# EAGLE design trezor_v1.2-USB-C (EAGLE 7.3.0)
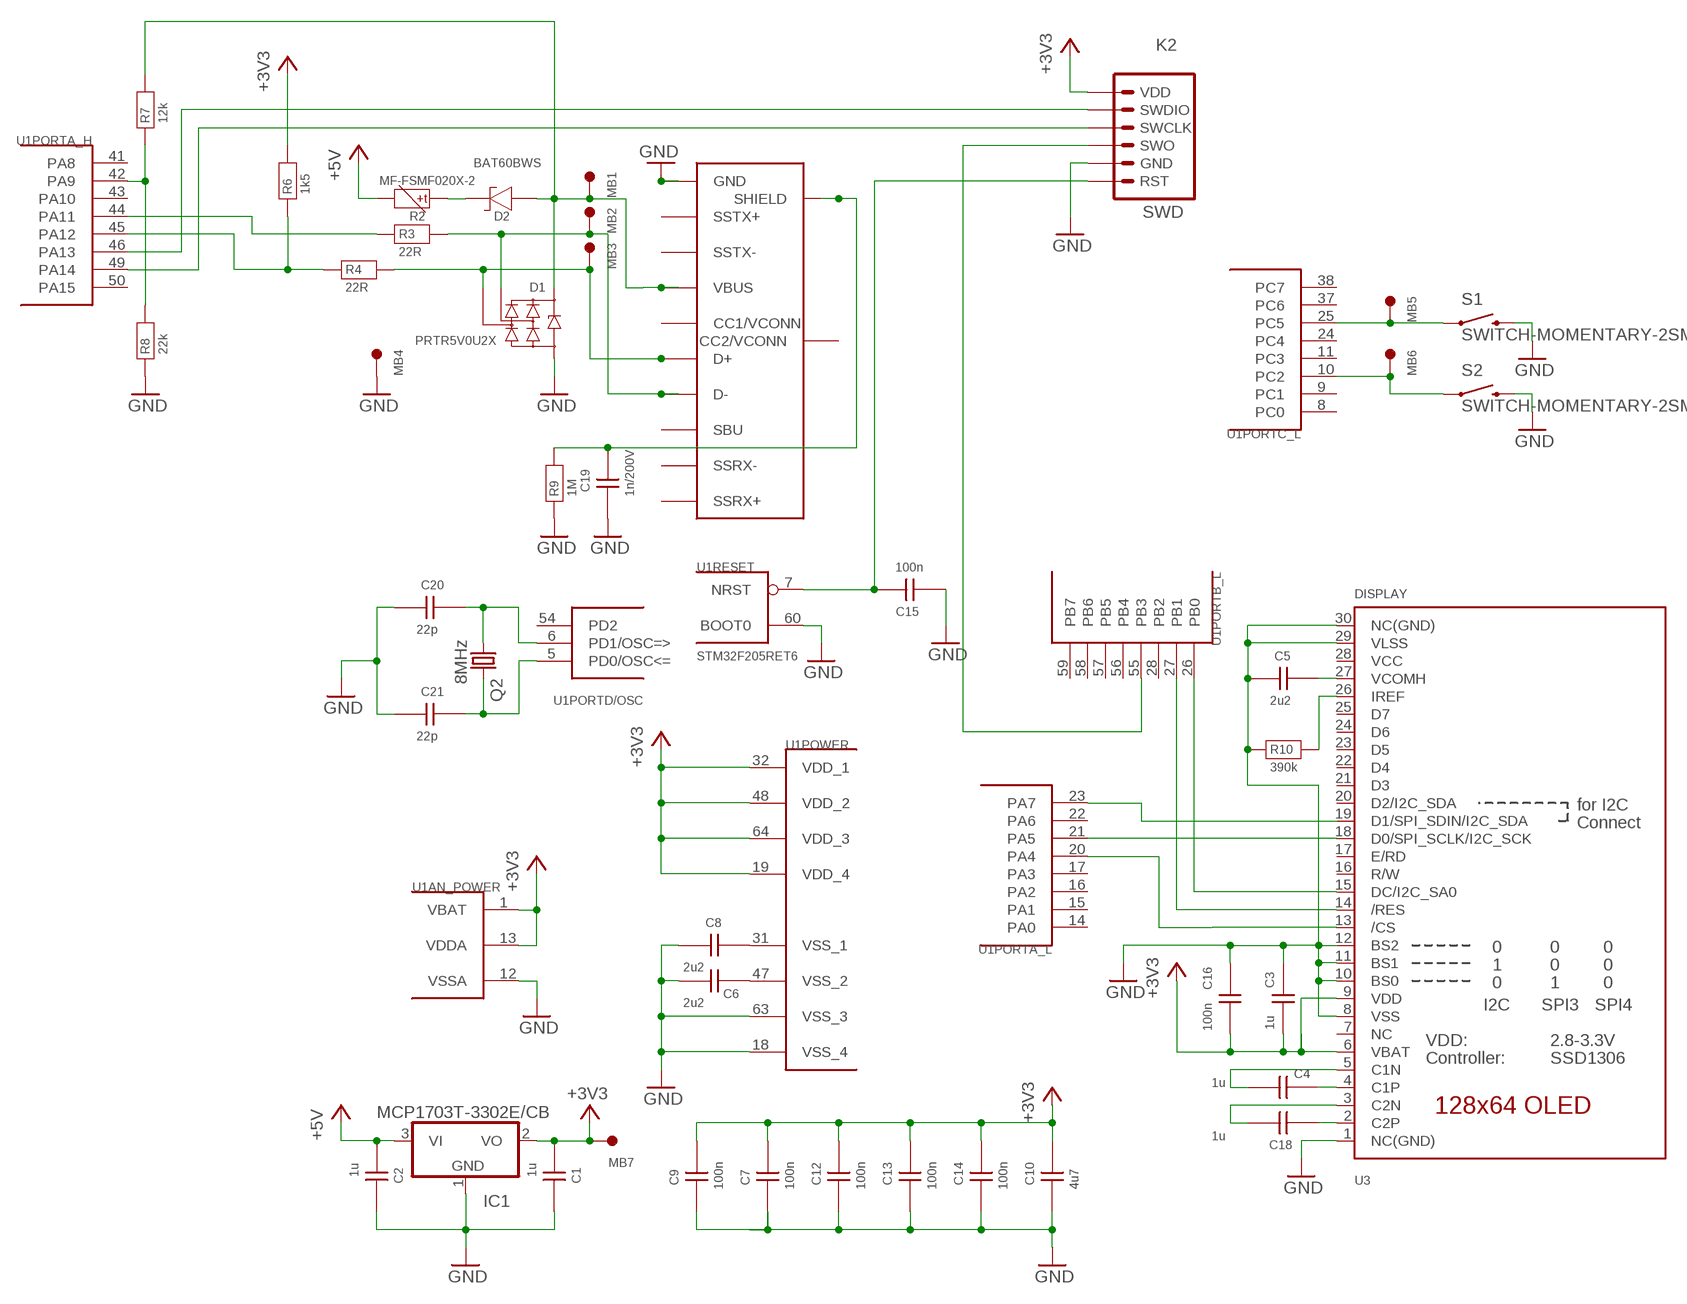
[diagram p0: schematic, sheet 1]

## Parts
C1  1u  C_0402  [0402]
C2  1u  C_0402  [0402]
C3  1u  C_0402  [0402]
C4  1u  C_0402  [0402]
C5  2u2  C_0603  [0603]
C6  2u2  C_0402  [0402]
C7  100n  C_0402  [0402]
C8  2u2  C_0402  [0402]
C9  100n  C_0402  [0402]
C10  4u7  C_0603  [0603]
C12  100n  C_0402  [0402]
C13  100n  C_0402  [0402]
C14  100n  C_0402  [0402]
C15  100n  C_0402  [0402]
C16  100n  C_0402  [0402]
C18  1u  C_0402  [0402]
C19  1n/200V  C_0603  [0603]
C20  22p  C_0402  [0402]
C21  22p  C_0402  [0402]
D1  PRTR5V0U2X  PRTR5V0_SOT143B  [SOT143B]
D2  BAT60BWS  DS_SOD323  [SOD323]
IC1  MCP1703T-3302E/CB  MCP1703CB  [SOT23]
K2  SWD  [SWD]
MB1  MB_1.50  [MB1.5]
MB2  MB_1.50  [MB1.5]
MB3  MB_1.50  [MB1.5]
MB4  MB_1.50  [MB1.5]
MB5  MB_1.50  [MB1.5]
MB6  MB_1.50  [MB1.5]
MB7  MB_1.50  [MB1.5]
Q2  8MHz  CRYSTALCTS406  [CTS406]
R2  MF-FSMF020X-2  POLYSWITCH_0603  [0603]
R3  22R  R_0402  [0402]
R4  22R  R_0402  [0402]
R6  1k5  R_0402  [0402]
R7  12k  R_0402  [0402]
R8  22k  R_0402  [0402]
R9  1M  R_0603  [0603]
R10  390k  R_0402  [0402]
S1  SWITCH-MOMENTARY-2SMD  [TACTILE_SWITCH_SMD]
S2  SWITCH-MOMENTARY-2SMD  [TACTILE_SWITCH_SMD]
U1  STM32F205RET6  STM32F10XRXT6  [TQFP64]
U3  DISPLAY  DISP_OLED_UG-2864HSWEG010.96"  [UG-2864HSWEG01_0.96IN_WRAPAROUND]
U$1  USB-TYPE-CHYBRID  [USB-TYPE-C-HYBRID]

## Nets
+3V3: C1.P$1 C3.P$1 C7.P$2 C9.P$2 C10.2 C12.P$2 C13.P$2 C14.P$2 C16.P$1 IC1.2(VO) K2.6(VDD) MB7.1 R6.P$2 U1.1(AN_POWER:VBAT) U1.13(AN_POWER:VDDA) U1.19(POWER:VDD_4) U1.32(POWER:VDD_1) U1.48(POWER:VDD_2) U1.64(POWER:VDD_3) U3.6(VBAT) U3.9(VDD)
+5V: C2.P$1 IC1.3(VI) R2.2
GND: C1.P$2 C2.P$2 C3.P$2 C5.1 C6.P$1 C7.P$1 C8.P$1 C9.P$1 C10.1 C12.P$1 C13.P$1 C14.P$1 C15.P$1 C16.P$2 C19.1 C20.P$1 C21.P$1 D1.1(GND) IC1.1(GND) K2.2(GND) MB4.1 R8.P$1 R9.1 R10.P$1 S1.3 S1.4 S2.3 S2.4 U1.12(AN_POWER:VSSA) U1.18(POWER:VSS_4) U1.60(RESET:BOOT0) U1.63(POWER:VSS_3) U3.1(NC(GND)) U3.8(VSS) U3.10(BS0) U3.11(BS1) U3.12(BS2) U3.29(VLSS) U3.30(NC(GND)) U$1.1(GND) U$1.12(GND) U$1.B1(GND) U$1.B12(GND)
N$1: U1.23(PORTA_L:PA7) U3.19(D1/SPI_SDIN/I2C_SDA)
N$2: C15.P$2 K2.1(RST) U1.7(RESET:NRST)
N$3: U1.26(PORTB_L:PB0) U3.15(DC/I2C_SA0)
N$4: C8.P$2 U1.31(POWER:VSS_1)
N$5: U1.21(PORTA_L:PA5) U3.18(D0/SPI_SCLK/I2C_SCK)
N$6: C5.2 U3.27(VCOMH)
N$7: U1.27(PORTB_L:PB1) U3.14(/RES)
N$8: C6.P$2 U1.47(POWER:VSS_2)
N$9: R10.P$2 U3.26(IREF)
N$10: C18.P$1 U3.2(C2P)
N$11: C4.P$1 U3.4(C1P)
N$12: C18.P$2 U3.3(C2N)
N$13: C4.P$2 U3.5(C1N)
N$14: K2.3(SWO) U1.55(PORTB_L:PB3)
N$15: K2.5(SWDIO) U1.46(PORTA_H:PA13)
N$16: U1.20(PORTA_L:PA4) U3.13(/CS)
N$17: K2.4(SWCLK) U1.49(PORTA_H:PA14)
N$18: R3.P$1 U1.44(PORTA_H:PA11)
N$19: MB5.1 S1.1 S1.2 U1.25(PORTC_L:PC5)
N$20: MB6.1 S2.1 S2.2 U1.10(PORTC_L:PC2)
N$22: D2.K R2.1
N$23: D1.2(I/O1) MB2.1 R3.P$2 U$1.7(D-) U$1.B7(D-)
N$24: D1.3(I/O2) MB3.1 R4.P$2 U$1.6(D+) U$1.B6(D+)
N$26: C19.2 R9.2 U$1.P$1(SHIELD) U$1.P$2(SHIELD) U$1.P$3(SHIELD) U$1.P$4(SHIELD) U$1.P$7(SHIELD) U$1.P$8(SHIELD) U$1.P$9(SHIELD) U$1.P$10(SHIELD) U$1.P$11(SHIELD) U$1.P$12(SHIELD) U$1.P$13(SHIELD) U$1.P$14(SHIELD) U$1.P$15(SHIELD) U$1.P$16(SHIELD) U$1.P$17(SHIELD) U$1.P$18(SHIELD) U$1.P$19(SHIELD) U$1.P$20(SHIELD) U$1.P$21(SHIELD) U$1.P$22(SHIELD) U$1.P$23(SHIELD) U$1.P$24(SHIELD) U$1.P$25(SHIELD) U$1.P$26(SHIELD) U$1.P$27(SHIELD) U$1.P$28(SHIELD) U$1.P$29(SHIELD) U$1.P$30(SHIELD) U$1.P$31(SHIELD) U$1.P$32(SHIELD) U$1.P$33(SHIELD) U$1.P$34(SHIELD) U$1.P$35(SHIELD)
N$27: R7.P$1 R8.P$2 U1.42(PORTA_H:PA9)
USB_D_P: R4.P$1 R6.P$1 U1.45(PORTA_H:PA12)
VBUS: D1.4(VCC) D2.A MB1.1 R7.P$2 U$1.4(VBUS) U$1.9(VBUS) U$1.B4(VBUS) U$1.B9(VBUS)
XTAL1: C20.P$2 Q2.1 U1.6(PORTD/OSC:PD1/OSC=>)
XTAL2: C21.P$2 Q2.3 U1.5(PORTD/OSC:PD0/OSC<=)
Unconnected: U1.2(PORTC_H:PC13) U1.3(PORTC_H:PC14) U1.4(PORTC_H:PC15) U1.8(PORTC_L:PC0) U1.9(PORTC_L:PC1) U1.11(PORTC_L:PC3) U1.14(PORTA_L:PA0) U1.15(PORTA_L:PA1) U1.16(PORTA_L:PA2) U1.17(PORTA_L:PA3) U1.22(PORTA_L:PA6) U1.24(PORTC_L:PC4) U1.28(PORTB_L:PB2) U1.29(PORTB_H:PB10) U1.30(PORTB_H:PB11) U1.33(PORTB_H:PB12) U1.34(PORTB_H:PB13) U1.35(PORTB_H:PB14) U1.36(PORTB_H:PB15) U1.37(PORTC_L:PC6) U1.38(PORTC_L:PC7) U1.39(PORTC_H:PC8) U1.40(PORTC_H:PC9) U1.41(PORTA_H:PA8) U1.43(PORTA_H:PA10) U1.50(PORTA_H:PA15) U1.51(PORTC_H:PC10) U1.52(PORTC_H:PC11) U1.53(PORTC_H:PC12) U1.54(PORTD/OSC:PD2) U1.56(PORTB_L:PB4) U1.57(PORTB_L:PB5) U1.58(PORTB_L:PB6) U1.59(PORTB_L:PB7) U1.61(PORTB_H:PB8) U1.62(PORTB_H:PB9) U3.7(NC) U3.16(R/W) U3.17(E/RD) U3.20(D2/I2C_SDA) U3.21(D3) U3.22(D4) U3.23(D5) U3.24(D6) U3.25(D7) U$1.2(SSTX+) U$1.3(SSTX-) U$1.5(CC1/VCONN) U$1.8(SBU) U$1.10(SSRX-) U$1.11(SSRX+) U$1.B2(SSTX+) U$1.B3(SSTX-) U$1.B5(CC2/VCONN) U$1.B8(SBU) U$1.B10(SSRX-) U$1.B11(SSRX+)

## Power pins joined to a net without a drawn wire
VCC: U3.28(VCC)

## Library data of the parts
C1-C10 C12-C16 C18-C21 = vyber:C
D1 = vyber:PRTR5V0
D2 = vyber:DS
IC1 = linear:MCP1703: 250 mA, 16V, Low Quiescent Current LDO Regulator Source: http://ww1.microchip.com/downloads/en/DeviceDoc/22049b.pdf
K2 = fabhack:SWD: SWD Miniature connector for ARM programming.
MB1-MB7 = vyber:MB
Q2 = crystal:CRYSTAL: CRYSTAL; OC_FARNELL: unknown; OC_NEWARK: unknown
R2 = vyber:POLYSWITCH
R3 R4 R6-R10 = vyber:R
S1 S2 = SparkFun-Electromechanical:SWITCH-MOMENTARY-2: Various NO switches- pushbuttons, reed, etc
U1 = stm32:STM32F10XRXT6: STM32F101/103 64pin LQFP
U3 = microbuilder:DISP_OLED_UG-2864HSWEG01: UG-2864HSWEG01 OLED display Both 1.3" and 0.96" models share the same FPC tab footprint, only the screen dimensions vary.
U$1 = lio:USB-TYPE-C

## Board
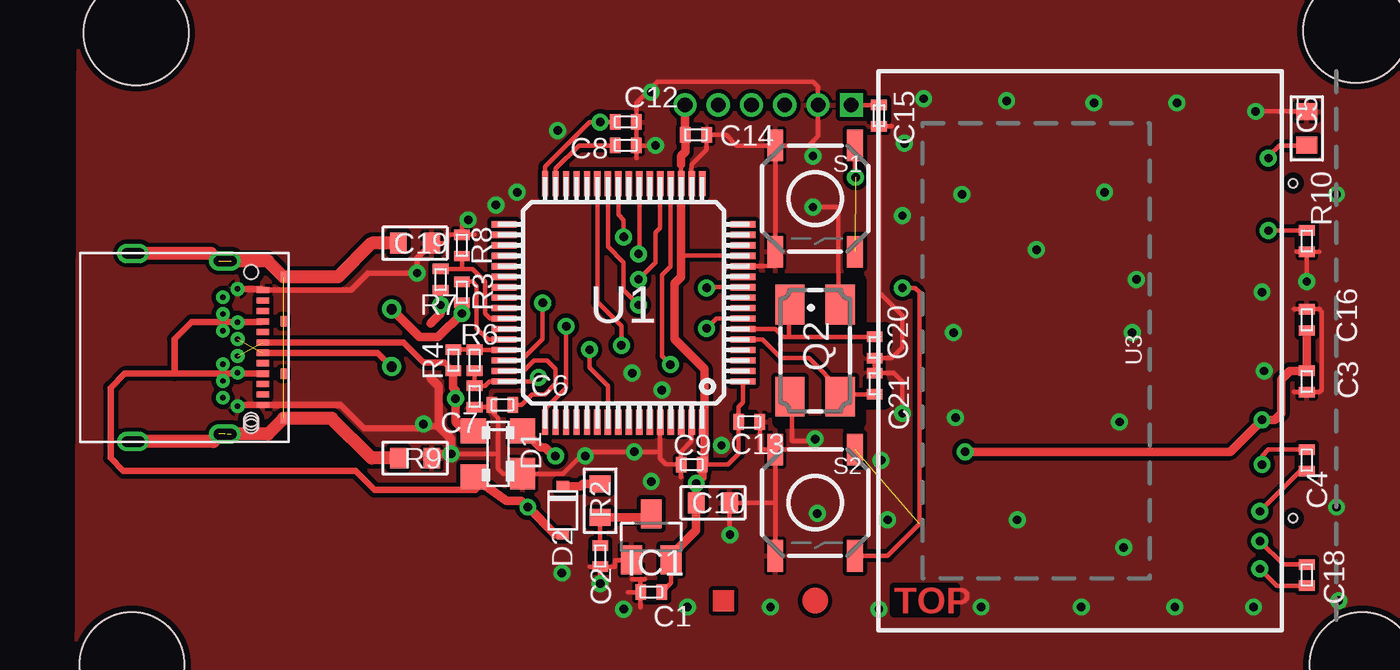
[diagram p1: board, top side]
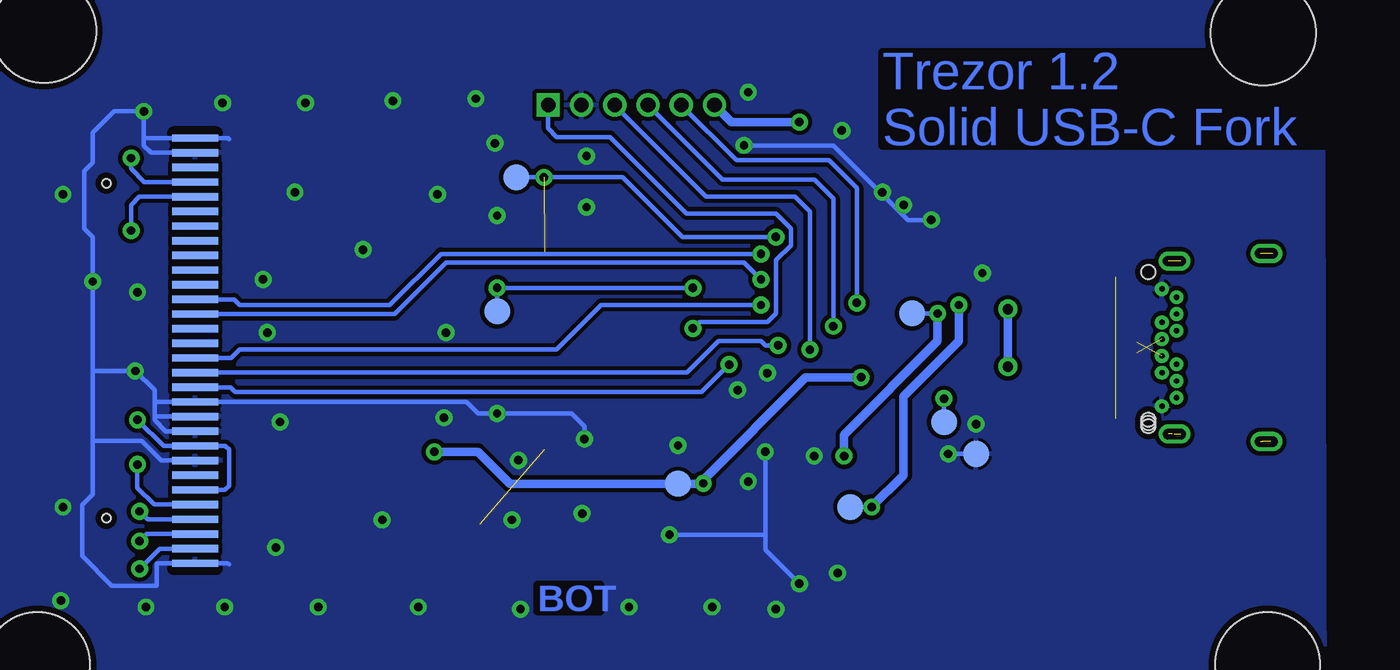
[diagram p2: board, bottom side, seen from below]

No outline drawn. Coordinates in mm, seen from the top.
Copper layers (1*16): Top 0.035mm / dielectric 1.5mm / Bottom 0.035mm
Design rules "default *": minimum track width 8mil, minimum drill 0.4mm, track to track 6mil, track to pad 6mil, pad to pad 6mil, via to via 6mil, smd to smd 0mil, copper to edge 0.3mm, drill to drill 8mil, minimum pad ring 8mil, minimum via ring 8mil, stop-mask expansion 4mil, vias tented up to drill 0.4mm, thermal gap 6mil
Holes 5 mm at -8.53,28.55 -8.74,-1.63 49.99,-1.63 49.68,28.65
tRestrict: 8 lines
bRestrict: 5 lines

### Footprints (pad centres in the part's own frame; a part is rotated, then mirrored left to right if it is on the bottom)
0402 = smd 0.5 x 0.75: P$1 -0.508,0; P$2 0.508,0
0603 = smd 0.8 x 1: 1 -0.8,0; 2 0.8,0
SOT143B = smd 1.5 x 1.2: 1 -0.948,-1.178 | smd 1.2 x 1.2: 2 1.103,-1.178; 3 1.098,1.178; 4 -1.098,1.178
SOD323 = smd 0.5 x 0.6: A -1.15,0; K 1.15,0
SOT23 = smd 1 x 1.4: 1 -0.95,-1.1; 2 0.95,-1.1; 3 0,1.1
SWD = drill 0.7 square: 1 0,0 | drill 0.7: 2 1.587,0; 3 3.175,0; 4 4.763,0; 5 6.35,0; 6 7.938,0
MB1.5 = smd 1.25 x 1.25: 1 0,0
CTS406 = smd 1.9 x 1.4: 1 -2.2,-1.2; 2 2.2,-1.2; 3 2.2,1.2; 4 -2.2,1.2
TACTILE_SWITCH_SMD = smd 1.524 x 0.762: 1 -2.54,1.905; 2 2.54,1.905; 3 -2.54,-1.905; 4 2.54,-1.905
TQFP64 = smd 1.2 x 0.3: 1 -5.7,3.75; 2 -5.7,3.25; 3 -5.7,2.75; 4 -5.7,2.25; 5 -5.7,1.75; 6 -5.7,1.25; 7 -5.7,0.75; 8 -5.7,0.25; 9 -5.7,-0.25; 10 -5.7,-0.75; 11 -5.7,-1.25; 12 -5.7,-1.75; 13 -5.7,-2.25; 14 -5.7,-2.75; 15 -5.7,-3.25; 16 -5.7,-3.75; 33 5.7,-3.75; 34 5.7,-3.25; 35 5.7,-2.75; 36 5.7,-2.25; 37 5.7,-1.75; 38 5.7,-1.25; 39 5.7,-0.75; 40 5.7,-0.25; 41 5.7,0.25; 42 5.7,0.75; 43 5.7,1.25; 44 5.7,1.75; 45 5.7,2.25; 46 5.7,2.75; 47 5.7,3.25; 48 5.7,3.75 | smd 0.3 x 1.2: 17 -3.75,-5.7; 18 -3.25,-5.7; 19 -2.75,-5.7; 20 -2.25,-5.7; 21 -1.75,-5.7; 22 -1.25,-5.7; 23 -0.75,-5.7; 24 -0.25,-5.7; 25 0.25,-5.7; 26 0.75,-5.7; 27 1.25,-5.7; 28 1.75,-5.7; 29 2.25,-5.7; 30 2.75,-5.7; 31 3.25,-5.7; 32 3.75,-5.7; 49 3.75,5.7; 50 3.25,5.7; 51 2.75,5.7; 52 2.25,5.7; 53 1.75,5.7; 54 1.25,5.7; 55 0.75,5.7; 56 0.25,5.7; 57 -0.25,5.7; 58 -0.75,5.7; 59 -1.25,5.7; 60 -1.75,5.7; 61 -2.25,5.7; 62 -2.75,5.7; 63 -3.25,5.7; 64 -3.75,5.7
UG-2864HSWEG01_0.96IN_WRAPAROUND = smd 0.35 x 2.2 bottom: 1 -10.15,-1.2; 2 -9.45,-1.2; 3 -8.75,-1.2; 4 -8.05,-1.2; 5 -7.35,-1.2; 6 -6.65,-1.2; 7 -5.95,-1.2; 8 -5.25,-1.2; 9 -4.55,-1.2; 10 -3.85,-1.2; 11 -3.15,-1.2; 12 -2.45,-1.2; 13 -1.75,-1.2; 14 -1.05,-1.2; 15 -0.35,-1.2; 16 0.35,-1.2; 17 1.05,-1.2; 18 1.75,-1.2; 19 2.45,-1.2; 20 3.15,-1.2; 21 3.85,-1.2; 22 4.55,-1.2; 23 5.25,-1.2; 24 5.95,-1.2; 25 6.65,-1.2; 26 7.35,-1.2; 27 8.05,-1.2; 28 8.75,-1.2; 29 9.45,-1.2; 30 10.15,-1.2 | hole 0.4: -8,-5.45; 8,-5.45
USB-TYPE-C-HYBRID = smd 0.29 x 0.6: 1 -2.75,0.56; 2 -2.25,0.56; 3 -1.75,0.56; 4 -1.25,0.56; 5 -0.75,0.56; 6 -0.25,0.56; 7 0.25,0.56; 8 0.75,0.56; 9 1.25,0.56; 10 1.75,0.56; 11 2.25,0.56; 12 2.75,0.56 | drill 0.254 pad 0.406: B1 2.8,-0.65; B2 2.4,-1.35; B3 1.6,-1.35; B4 1.2,-0.65; B5 0.8,-1.35; B6 0.4,-0.65; B7 -0.4,-0.65; B8 -0.8,-1.35; B9 -1.2,-0.65; B10 -1.6,-1.35; B11 -2.4,-1.35; B12 -2.8,-0.65 | smd 0.5 x 0.3: P$1 1.25,1.55; P$2 3.38,1.55; P$3 -1.25,1.55; P$4 -3.37,1.55 | drill 0.5: P$7 -4.13,-0.95; P$8 -4.49,-5.34; P$9 4.49,-5.34; P$10 4.13,-0.95; P$11 -4.13,-1.05; P$12 -4.13,-1.15; P$13 -4.13,-1.25; P$14 -4.13,-1.25; P$15 -4.13,-1.35; P$16 -4.13,-1.45; P$17 -4.13,-1.55; P$18 4.13,-1.05; P$19 4.13,-1.15; P$20 4.13,-1.25; P$21 4.13,-1.35; P$22 4.13,-1.45; P$23 4.13,-1.55; P$24 -4.49,-5.44; P$25 -4.49,-5.54; P$26 -4.49,-5.64; P$27 -4.49,-5.74; P$28 -4.49,-5.84; P$29 -4.49,-5.94; P$30 4.49,-5.44; P$31 4.49,-5.54; P$32 4.49,-5.64; P$33 4.49,-5.74; P$34 4.49,-5.84; P$35 4.49,-5.94 | hole 0.65: -3.6,0; 3.45,0; 3.75,0; 3.6,0

### Placement (x,y rotation side)
C1  16.05,1.83 180 top
C2  13.61,3.56 270 top
C3  47.35,11.89 270 top
C4  47.35,8.13 90 top
C5  47.35,23.98 270 top
C6  8.94,10.77 0 top
C7  7.62,11.18 90 top
C8  14.83,23.16 180 top
C9  17.98,7.92 0 top
C10  19,6.1 180 top
C12  14.83,24.28 180 top
C13  20.73,9.96 180 top
C14  18.19,23.67 180 top
C15  26.92,24.59 90 top
C16  47.35,14.83 90 top
C18  47.35,2.64 90 top
C19  4.78,18.49 180 top
C20  26.72,13.51 90 top
C21  26.72,11.79 270 top
D1  8.74,8.43 90 top
D2  11.84,5.74 90 top
IC1  16.05,4.47 0 top
K2  25.6,25.1 180 top
MB1  11.18,5.89 0 bottom
MB2  8.23,15.14 0 bottom
MB3  6.71,9.96 0 bottom
MB4  5.18,8.43 0 bottom
MB5  27.13,21.64 0 bottom
MB6  28.04,15.24 0 bottom
MB7  19.41,7.01 0 bottom
Q2  23.88,13.36 270 top
R2  13.61,6.2 270 top
R3  7.01,16.15 270 top
R4  6.6,12.9 270 top
R6  7.62,12.9 270 top
R7  5.99,16.76 270 top
R8  7.01,18.39 270 top
R9  4.78,8.23 180 top
R10  47.35,18.59 90 top
S1  23.88,20.62 270 top
S2  23.88,6.1 270 top
U1  14.73,15.65 180 top
U3  41.25,13.36 90 top
U$1  -3.05,13.51 270 top
U$3  [BADMARK]  19.51,1.42 0 top
U$4  [CENTR]  23.88,1.42 0 top

### Tracks (layer width: path | path; a pad name or v marks a point on that pad's centre or on a via)
+3V3  (via drill 0.4)
  Top 0.203: R6.P$2 C7.P$2 8.13,11.68 8.34,11.9 U1.48 10.47,11.9 v10.67,12.09 10.53,11.95 | C9.P$2 19.71,7.92 20.22,8.43 C13.P$2 20.22,10.67 20.43,10.88 U1.1 | IC1.2 17,2.27 C1.P$1 | U1.32 10.98,22.16 13.11,24.28 v13.61,24.28 C12.P$2 | 17.67,23.69 C14.P$2 | 17.48,20.41 U1.19 17.48,22.34 17.48,22.25 | U1.13 17.5,17.9 17.48,17.88 | U1.64 18.58,9.95 18.59,9.96
  Top 0.406: IC1.2 17,3.59 18.19,4.78 18.19,6.08 C10.2 v18.2,7.02 18.49,7.32 C9.P$2 18.59,8.03 18.59,9.96 18.59,12.5 17.17,13.92 17.17,16.56 17.48,16.87 17.48,17.88 17.48,20.41 | K2.6 17.67,23.69 | C14.P$2 17.68,22.86 17.48,22.66 17.48,22.25 | v31.04,8.53 43.69,8.53 v45.21,10.06 45.82,10.06 46.13,10.36 46.13,11.99 46.53,12.39 C3.P$1 C16.P$1
  Bottom 0.203: U3.6 41.04,6.71 40.84,6.91 40.84,8.64 41.02,8.81 U3.9 43.96,8.81 v45.21,10.06 | MB7.1 18.19,7.01 v18.2,7.02 18.21,7.01
  Bottom 0.406: v10.67,12.09 13.31,12.09 18.2,7.2 v18.2,7.02 | K2.6 16.85,24.28 v13.61,24.28 | 18.21,7.01 27.43,7.01 28.96,8.53 v31.04,8.53
+5V
  Top 0.203: R2.2 C2.P$1
  Top 0.406: R2.2 16.05,5.4 IC1.3
GND  (via drill 0.4)
  Top 0.2: 47.24,18.09 47.95,18.09
  Top 0.203: C6.P$1 8.53,10.67 | 8.53,10.67 C7.P$1 | 8.53,10.67 8.53,10.36 8.74,10.16 8.74,8.43 | 8.74,8.43 8.74,7.72 8.97,7.49 D1.1 11.85,7.49 12.9,8.53 v15.24,8.53 16.48,8.53 | C13.P$1 21.23,8.64 S2.3 | S2.4 21.97,6.1 | 21.97,6.1 S2.3 | 21.97,6.1 C10.1 19.8,4.58 v19.81,4.57 | U1.60 16.48,8.53 | 16.48,8.53 16.48,8.21 16.76,7.92 C9.P$1 | U1.63 17.98,9.04 17.48,8.53 C9.P$1 | 14.94,1.83 C1.P$2 | C2.P$2 14.33,3.05 14.33,3.35 15.09,3.35 IC1.1 | C19.1 6.3,18.49 6.3,18.9 R8.P$1 | v6.5,8.43 8.74,8.43 | U1.12 21.97,17.4 S1.4 S1.3 | C8.P$1 C12.P$1 15.34,25.2 16.36,26.21 23.77,26.21 24.02,25.97 K2.2 24.02,23.61 23.57,23.16 S1.3 | S1.3 20.12,23.16 19.61,23.67 C14.P$1 18.69,22.96 17.98,22.25 U1.18 | v47.35,16.66 R10.P$1 47.24,18.09 46.84,18.09 | v44.91,24.79 47.33,24.79 C5.1 | v23.88,9.14 23.88,9.04 | 23.88,9.04 23.88,8.94 23.57,8.64 S2.3 | v28.04,10.36 28.04,11.89 27.64,12.29 C21.P$1 C20.P$1 27.53,13.01 28.04,13.51 28.04,15.04 26.92,16.15 C15.P$1 27.53,24.08 | R8.P$1 7.01,19.3 v7.32,19.61 | v16.26,23.16 C8.P$1 | v13.61,2.23 C2.P$2 | C8.P$1 15.34,22.55 | C9.P$1 17.48,7.32 | C2.P$2 13.11,3.05 | R8.P$1 7.62,18.9 | C1.P$2 15.54,1.12 | C1.P$2 15.54,2.44 | 15.54,2.44 15.14,2.44 | 15.54,2.44 15.75,2.44 | 46.74,11.38 C3.P$2 47.95,11.38 48.06,11.48 48.06,15.24 47.95,15.34 C16.P$2 46.74,15.34 | 23.88,9.04 22.76,9.04 22.76,11.28 | v23.77,20.22 24.99,20.22 24.99,15.65
  Top 0.254: U$1.1 1.73,16.26 2.54,17.07 v4.88,17.07 4.88,17.78 5.58,18.48 C19.1
  Top 0.305: 5.89,9.75 5.28,9.75 v5.18,9.86 4.98,9.65 2.34,9.65 1.23,10.76 U$1.12 -3.65,10.76 U$1.B1 | U$1.1 -2.54,16.31 U$1.B12
  Top 0.406: 5.79,8.23 R9.1 5.78,8.43 v6.5,8.43 6.5,9.14 5.89,9.75 5.89,11.68 5.52,12.06
  Bottom 0.203: 44.4,10.91 U3.12 29.5,10.91 28.96,10.36 v28.04,10.36 24.49,10.36 23.88,9.75 v23.88,9.14 | 47.35,9.04 47.35,6.5 47.85,5.99 47.85,3.56 46.43,2.13 44.3,2.13 44.3,3.21 U3.1 40.9,3.21 40.84,3.15 | 47.35,9.04 47.35,12.39 | 47.35,12.39 v47.35,16.66 47.35,18.8 47.75,19.2 47.75,21.95 47.35,22.35 47.35,23.77 46.33,24.79 v44.91,24.79 44.91,23.51 | 47.35,9.04 45.01,9.04 44.08,8.11 U3.8 | 44.4,10.91 44.4,11.48 v45.31,12.39 47.35,12.39 | U3.10 43.85,9.51 44.4,10.06 44.4,10.21 | U3.11 44.4,10.21 | 44.4,10.21 44.4,10.91 | U3.29 44.55,22.81 44.91,23.16 44.91,23.51 | 44.91,23.51 U3.30 40.88,23.51 40.84,23.47 | v7.32,19.61 8.43,19.61 11.99,23.16 v16.26,23.16 | MB4.1 v6.5,8.43 | v15.24,8.53 15.24,4.57 | 15.24,4.57 15.24,3.86 v13.61,2.23 | v19.81,4.57 15.24,4.57
  other vias: 15.14,12.29 23.77,22.66 9.65,20.93 30.48,14.22 39.01,14.22 19.41,8.84 29.06,25.4 33.02,25.3 37.19,25.2 41.15,25.2 48.77,20.83 45.21,16.15 48.77,5.89 48.87,1.42 44.81,1.12 41.05,1.12 36.58,1.12 31.8,1.12 33.53,5.28 38.4,9.96 30.58,10.16 27.33,5.28 23.98,5.59 17.78,1.12 12.9,8.33 16.56,11.48 28.04,19.81 28.14,23.27 16.05,25.7 8.64,20.32 11.79,2.74 14.73,1.02 16.05,7.11 26.92,1.02 21.74,1.12 11.58,23.88 27.03,8.13 30.89,20.83 37.69,20.93 34.44,18.19 39.22,16.76 38.61,3.96
  pour Top (isolate 0.203): -11.38,-4.47 52.63,-4.37 52.43,31.19 -11.28,31.19
  pour Bottom (isolate 0.203): -11.48,-4.47 52.63,-4.37 52.43,31.29 -11.38,31.19
N$1  (via drill 0.4)
  Top 0.203: U1.23 15.48,18.02 v15.44,17.98
  Bottom 0.203: v15.44,17.98 30.73,17.98 33.16,15.54 40.34,15.54 40.6,15.81 U3.19
N$2  (via drill 0.4)
  Top 0.203: U1.7 19.16,14.9 v18.69,14.43 | C15.P$2 K2.1
  Bottom 0.203: v18.69,14.43 18.39,14.73 15.14,14.73 14.73,15.14 14.73,17.68 14.02,18.39 14.02,19.2 14.73,19.91 19,19.91 22.66,23.57 25.2,23.57 25.6,23.98 K2.1
N$3  (via drill 0.4)
  Top 0.203: U1.26 13.98,18.33 14.73,17.58 14.73,16.26 v15.44,15.54
  Bottom 0.203: v15.44,15.54 23.08,15.54 25.21,13.42 40.33,13.42 40.74,13.01 U3.15
N$4
  Top 0.203: U1.31 11.48,22.05 12.6,23.16 C8.P$2
N$5  (via drill 0.4)
  Top 0.203: v15.44,16.76 16.26,17.58 16.26,19 16.48,19.23 U1.21
  Bottom 0.203: U3.18 32.95,15.11 30.48,17.58 16.26,17.58 v15.44,16.76
N$6  (via drill 0.4)
  Top 0.203: v45.52,22.55 45.52,22.66 46.02,23.16 47.33,23.16 C5.2
  Bottom 0.203: U3.27 44.88,21.41 45.52,22.05 v45.52,22.55
N$7  (via drill 0.4)
  Top 0.203: v14.63,13.61 14.63,14.53 13.48,15.68 U1.27
  Bottom 0.203: U3.14 18.98,12.31 17.48,13.82 15.44,13.82 15.24,13.61 v14.63,13.61
N$8
  Top 0.203: C6.P$2 9.86,10.77 10.36,11.28 10.97,11.28 11.48,11.79 11.48,12.5 11.07,12.9 10.46,12.9 9.96,12.4 U1.47
N$9  (via drill 0.4)
  Top 0.203: v45.52,19.1 R10.P$2
  Bottom 0.203: U3.26 45.13,20.71 45.52,20.32 v45.52,19.1
N$10  (via drill 0.4)
  Top 0.203: v45.11,2.95 45.92,2.13 C18.P$1
  Bottom 0.203: U3.2 44.15,3.91 v45.11,2.95
N$11  (via drill 0.4)
  Top 0.203: C4.P$1 47.04,7.62 v45.11,5.69
  Bottom 0.203: U3.4 44.73,5.31 v45.11,5.69
N$12  (via drill 0.4)
  Top 0.203: v45.11,4.27 46.23,3.15 C18.P$2
  Bottom 0.203: U3.3 44.77,4.61 v45.11,4.27
N$13  (via drill 0.4)
  Top 0.203: C4.P$2 45.52,8.64 45.21,8.33 v45.21,7.92
  Bottom 0.203: U3.5 44.41,6.01 45.21,6.81 v45.21,7.92
N$14  (via drill 0.4)
  Top 0.203: U1.55 13.98,11.68 13.11,12.56 v13.11,13.41
  Bottom 0.203: v13.11,13.41 13.11,20.02 13.82,20.73 18.06,20.73 K2.3
N$15  (via drill 0.4)
  Top 0.203: U1.46 9.85,12.9 10.87,13.92 v10.87,15.65
  Bottom 0.203: v10.87,15.65 10.87,21.13 12.19,22.45 16.61,22.45 K2.5
N$16  (via drill 0.4)
  Top 0.203: v16.97,12.7 16.98,12.71 16.95,12.71 16.56,13.11 16.56,16.97 16.98,17.39 U1.20
  Bottom 0.203: v16.97,12.7 18.29,11.38 40.54,11.38 40.77,11.61 U3.13
N$17  (via drill 0.4)
  Top 0.203: U1.49 10.98,10.58 11.99,11.58 v11.99,14.53
  Bottom 0.203: v11.99,14.53 11.99,20.62 12.9,21.54 17.29,21.54 K2.4
N$18
  Top 0.203: R3.P$1 7.52,16.66 7.72,16.46 7.72,14.43 8.25,13.9 U1.44
N$19  (via drill 0.4)  (1 unrouted)
  Top 0.203: U1.25 14.48,19.86 14.73,19.61 v14.73,18.8 | v25.81,21.64 25.78,21.67 S1.1
  Bottom 0.203: v14.73,18.8 19.2,18.8 22.05,21.64 v25.81,21.64 MB5.1
N$20  (via drill 0.4)  (1 unrouted)
  Top 0.203: v28.04,16.36 28.65,16.36 28.85,16.15 28.85,5.08 27.33,3.56 S2.2 | U1.10 18.73,16.4 v18.69,16.36
  Bottom 0.203: v18.69,16.36 v28.04,16.36 MB6.1
N$22
  Top 0.406: R2.1 12.8,7.01 12.68,6.89 D2.K
N$23  (via drill 0.4, 0.5)  (1 unrouted)
  Top 0.203: R3.P$2 v7.01,15.14 7.01,14.94
  Top 0.305: U$1.7 2.99,13.26 v3.66,12.6
  Top 0.406: v7.01,15.14 5.88,14.01 4.99,14.01 v3.66,15.34 | v11.48,8.33 11.38,8.33 10.97,8.74 10.77,8.74 9.97,9.54 D1.2
  Bottom 0.203: MB2.1 v7.01,15.14
  Bottom 0.406: v7.01,15.14 7.01,13.82 11.48,9.35 v11.48,8.33 | v3.66,15.34 v3.66,12.6
N$24  (via drill 0.4)  (1 unrouted)
  Top 0.305: U$1.6 4.22,13.76 5.18,12.8 6.2,12.8 R4.P$2
  Top 0.406: R4.P$2 6.6,11.58 6.71,11.48 v6.71,11.07 MB3.1 7.13,9.53 D1.3
  Bottom 0.203: v6.71,11.07 MB3.1
N$26  (25 unrouted)
  Top 0.61: C19.2 2.71,18.49 1.1,16.88 U$1.P$4 -2.26,17.64 U$1.P$17 -4.96,18 U$1.P$8 | R9.2 2.71,8.23 0.81,10.13 U$1.P$2 -2.25,9.38 U$1.P$23 | U$1.P$35 U$1.P$34 | U$1.P$30 -4.86,9.02 U$1.P$22 U$1.P$10
N$27
  Top 0.203: R7.P$1 7.01,17.27 | 7.01,17.27 7.52,17.27 8.13,16.66 8.13,15.14 8.37,14.9 U1.42 | R8.P$2 7.01,17.27
USB_D_P
  Top 0.203: R4.P$1 R6.P$1 7.63,13.4 U1.45
VBUS  (via drill 0.4)
  Top 0.203: R7.P$2 v5.99,15.54
  Top 0.305: U$1.9 -3.65,12.26 | -3.65,12.26 -6.71,12.26 | -6.71,12.26 -9.07,12.26 -9.75,11.58 -9.75,8.23 -9.14,7.62 1.93,7.62 2.85,6.71 7.66,6.71 7.98,7.03 | U$1.4 -2.51,14.76 -2.54,14.73 -3.68,14.73 U$1.B9 -3.72,14.73 -5.89,14.73 -6.71,13.92 -6.71,12.26 | U$1.B4 -3.65,12.26
  Top 0.406: 5.52,14.66 5.99,15.14 v5.99,15.54 | D1.4 7.98,7.03 9.14,6.2 9.86,6.2 v10.16,5.89 11.46,4.59 D2.A 11.67,4.59
  Bottom 0.203: MB1.1 v10.16,5.89
  Bottom 0.406: v5.99,15.54 5.99,13.82 8.64,11.18 8.64,7.42 v10.16,5.89
XTAL1
  Top 0.203: U1.6 21.98,14.4 22.35,14.02 22.63,14.02 | Q2.1 22.63,15.31 22.63,14.02 | 22.63,14.02 C20.P$2
XTAL2
  Top 0.203: U1.5 21.36,13.9 22.25,13.01 23.57,13.01 25.13,11.45 Q2.3 25.29,11.28 C21.P$2

### Text on the board
Top: TOP
Bottom: Trezor 1.2 / Solid USB-C Fork | BOT